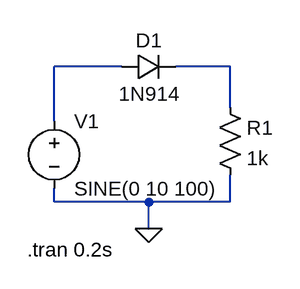
[diagram p0: schematic 3.Halfwaverec.asc]
3.Halfwaverec.asc, the LTspice schematic file:
Version 4
SHEET 1 1144 680
WIRE 960 64 880 64
WIRE 1088 64 1024 64
WIRE 1088 112 1088 64
WIRE 880 128 880 64
WIRE 880 224 880 208
WIRE 992 224 880 224
WIRE 1088 224 1088 192
WIRE 1088 224 992 224
WIRE 992 256 992 224
FLAG 992 256 0
SYMBOL voltage 880 112 R0
WINDOW 123 0 0 Left 0
WINDOW 39 0 0 Left 0
SYMATTR InstName V1
SYMATTR Value SINE(0 10 100)
SYMBOL diode 960 80 R270
WINDOW 0 32 32 VTop 2
WINDOW 3 0 32 VBottom 2
SYMATTR InstName D1
SYMATTR Value 1N914
SYMBOL res 1072 96 R0
SYMATTR InstName R1
SYMATTR Value 1k
TEXT 848 280 Left 2 !.tran 0.2s

The netlist it stands for:
* 3.Halfwaverec.asc
V1 N001 0 SINE(0 10 100)
D1 N001 N002 1N914
R1 N002 0 1k
.model D D
.lib standard.dio
.tran 0.2s
.backanno
.end